# EAGLE design Main (EAGLE 6.3)
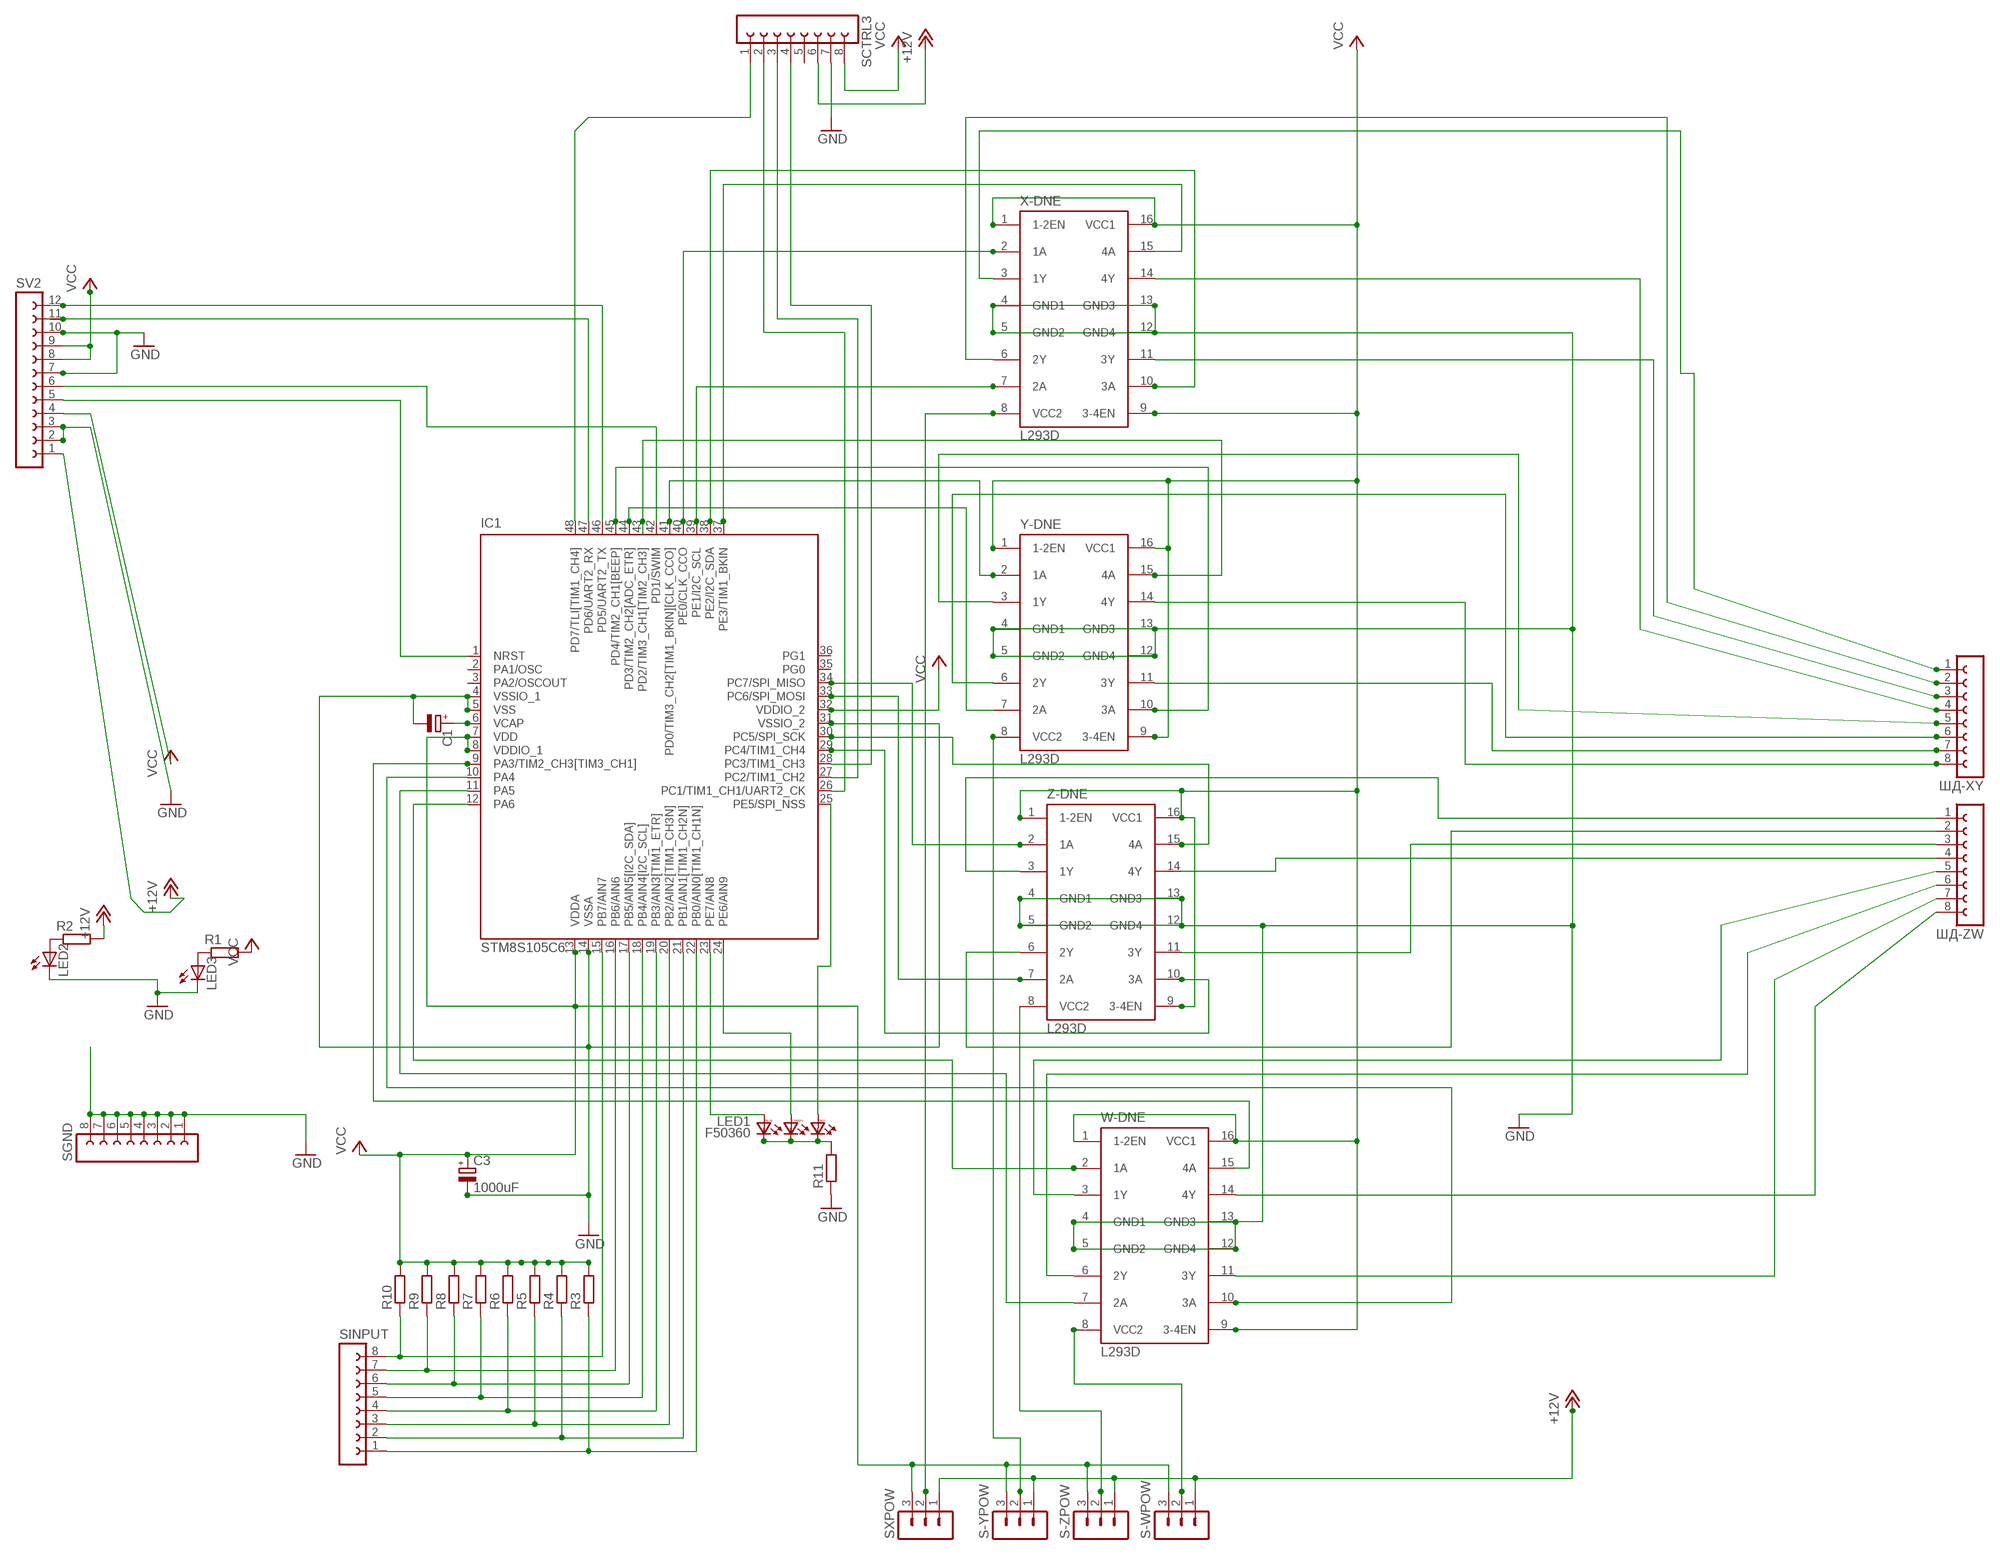
[diagram p0: schematic, sheet 1]

## Parts
C1  CPOL-EU085CS-1AR  [085CS_1AR]
C3  1000uF  CPOL-EUSANYO_9E  [SANYO-OSCON_9E]
IC1  STM8S105C6  [LQFP48-7X7]
LED1  F50360  [F50360]
LED2  LED3MM  [LED3MM]
LED3  LED3MM  [LED3MM]
R1  R-EU_0204/7  [0204/7]
R2  R-EU_0204/7  [0204/7]
R3  R-EU_M0805  [M0805]
R4  R-EU_M0805  [M0805]
R5  R-EU_M0805  [M0805]
R6  R-EU_M0805  [M0805]
R7  R-EU_M0805  [M0805]
R8  R-EU_M0805  [M0805]
R9  R-EU_M0805  [M0805]
R10  R-EU_M0805  [M0805]
R11  R-EU_0204/7  [0204/7]
S-WPOW  MA03-1  [MA03-1]
S-YPOW  MA03-1  [MA03-1]
S-ZPOW  MA03-1  [MA03-1]
SCTRL3  FE08-1  [FE08]
SGND  FE08-1  [FE08]
SINPUT  FE08-1  [FE08]
SV2  FE12-1  [FE12]
SXPOW  MA03-1  [MA03-1]
W-DNE  L293D  [DIL16]
X-DNE  L293D  [DIL16]
Y-DNE  L293D  [DIL16]
Z-DNE  L293D  [DIL16]
ШД-XY  FE08-1  [FE08]
ШД-ZW  FE08-1  [FE08]

## Nets
+12V: R2.2 S-WPOW.1 S-YPOW.1 S-ZPOW.1 SCTRL3.6 SV2.1 SXPOW.1
GND: C1.- C3.- IC1.4(VSSIO_1) IC1.5(VSS) IC1.14(VSSA) IC1.31(VSSIO_2) LED2.K(C) LED3.K(C) R11.1 SCTRL3.7 SGND.1 SGND.2 SGND.3 SGND.4 SGND.5 SGND.6 SGND.7 SGND.8 SV2.2 SV2.3 SV2.7 SV2.10 W-DNE.4(GND1) W-DNE.5(GND2) W-DNE.12(GND4) W-DNE.13(GND3) X-DNE.4(GND1) X-DNE.5(GND2) X-DNE.12(GND4) X-DNE.13(GND3) Y-DNE.4(GND1) Y-DNE.5(GND2) Y-DNE.12(GND4) Y-DNE.13(GND3) Z-DNE.4(GND1) Z-DNE.5(GND2) Z-DNE.12(GND4) Z-DNE.13(GND3)
IN-Y1: IC1.41(PD0/TIM3_CH2[TIM1_BKIN][CLK_CCO]) Y-DNE.2(1A)
IN-Y2: IC1.44(PD3/TIM2_CH2[ADC_ETR]) Y-DNE.7(2A)
IN-Y3: IC1.45(PD4/TIM2_CH1[BEEP]) Y-DNE.10(3A)
IN-Y4: IC1.43(PD2/TIM3_CH1[TIM2_CH3]) Y-DNE.15(4A)
N$1: IC1.22(PB0/AIN0[TIM1_CH1N]) R3.1 SINPUT.1
N$6: IC1.47(PD6/UART2_RX) SV2.11
N$7: C1.+ IC1.6(VCAP)
N$13: IC1.40(PE0/CLK_CCO) X-DNE.2(1A)
N$14: IC1.39(PE1/I2C_SCL) X-DNE.7(2A)
N$15: IC1.38(PE2/I2C_SDA) X-DNE.10(3A)
N$16: IC1.37(PE3/TIM1_BKIN) X-DNE.15(4A)
N$17: IC1.34(PC7/SPI_MISO) Z-DNE.2(1A)
N$18: IC1.33(PC6/SPI_MOSI) Z-DNE.7(2A)
N$19: IC1.30(PC5/SPI_SCK) Z-DNE.15(4A)
N$20: IC1.29(PC4/TIM1_CH4) Z-DNE.10(3A)
N$21: IC1.9(PA3/TIM2_CH3[TIM3_CH1]) W-DNE.15(4A)
N$22: IC1.10(PA4) W-DNE.10(3A)
N$23: IC1.11(PA5) W-DNE.7(2A)
N$24: IC1.12(PA6) W-DNE.2(1A)
N$35: IC1.21(PB1/AIN1[TIM1_CH2N]) R4.1 SINPUT.2
N$36: IC1.20(PB2/AIN2[TIM1_CH3N]) R5.1 SINPUT.3
N$38: IC1.19(PB3/AIN3[TIM1_ETR]) R6.1 SINPUT.4
N$41: IC1.18(PB4/AIN4[I2C_SCL]) R7.1 SINPUT.5
N$42: IC1.17(PB5/AIN5[I2C_SDA]) R8.1 SINPUT.6
N$43: IC1.16(PB6/AIN6) R9.1 SINPUT.7
N$44: IC1.15(PB7/AIN7) R10.1 SINPUT.8
N$45: LED1.BC LED1.GC LED1.RC R11.2
N$46: IC1.23(PE7/AIN8) LED1.BA
N$47: IC1.24(PE6/AIN9) LED1.GA
N$48: IC1.25(PE5/SPI_NSS) LED1.RA
N$49: IC1.48(PD7/TLI[TIM1_CH4]) SCTRL3.1
N$50: IC1.27(PC2/TIM1_CH2) SCTRL3.3
N$51: IC1.28(PC3/TIM1_CH3) SCTRL3.4
N$59: LED3.A R1.1
N$60: LED2.A R2.1
N$66: IC1.26(PC1/TIM1_CH1/UART2_CK) SCTRL3.2
PW1: W-DNE.3(1Y) ШД-ZW.5
PW2: W-DNE.6(2Y) ШД-ZW.6
PW3: W-DNE.11(3Y) ШД-ZW.7
PW4: W-DNE.14(4Y) ШД-ZW.8
PX1: X-DNE.3(1Y) ШД-XY.1
PX2: X-DNE.6(2Y) ШД-XY.2
PX3: X-DNE.11(3Y) ШД-XY.3
PX4: X-DNE.14(4Y) ШД-XY.4
PY1: Y-DNE.3(1Y) ШД-XY.5
PY2: Y-DNE.6(2Y) ШД-XY.6
PY3: Y-DNE.11(3Y) ШД-XY.7
PY4: Y-DNE.14(4Y) ШД-XY.8
PZ1: Z-DNE.3(1Y) ШД-ZW.1
PZ2: Z-DNE.6(2Y) ШД-ZW.2
PZ3: Z-DNE.11(3Y) ШД-ZW.3
PZ4: Z-DNE.14(4Y) ШД-ZW.4
RST: IC1.1(NRST) SV2.5
SWD: IC1.42(PD1/SWIM) SV2.6
TXD: IC1.46(PD5/UART2_TX) SV2.12
VCC: C3.+ IC1.7(VDD) IC1.8(VDDIO_1) IC1.13(VDDA) IC1.32(VDDIO_2) R1.2 R3.2 R4.2 R5.2 R6.2 R7.2 R8.2 R9.2 R10.2 S-WPOW.3 S-YPOW.3 S-ZPOW.3 SCTRL3.8 SV2.4 SV2.8 SV2.9 SXPOW.3 W-DNE.1(1-2EN) W-DNE.9(3-4EN) W-DNE.16(VCC1) X-DNE.1(1-2EN) X-DNE.9(3-4EN) X-DNE.16(VCC1) Y-DNE.1(1-2EN) Y-DNE.9(3-4EN) Y-DNE.16(VCC1) Z-DNE.1(1-2EN) Z-DNE.9(3-4EN) Z-DNE.16(VCC1)
VCC_W_SEL: S-WPOW.2 W-DNE.8(VCC2)
VCC_X_SEL: SXPOW.2 X-DNE.8(VCC2)
VCC_Y_SEL: S-YPOW.2 Y-DNE.8(VCC2)
VCC_Z_SEL: S-ZPOW.2 Z-DNE.8(VCC2)
Unconnected: IC1.2(PA1/OSC) IC1.3(PA2/OSCOUT) IC1.35(PG0) IC1.36(PG1) SCTRL3.5

## Library data of the parts
C1 = resistor:CPOL-EU: POLARIZED CAPACITOR, European symbol
C3 = rcl:CPOL-EU: POLARIZED CAPACITOR, European symbol
IC1 = st-microelectronics:STM8S105C: Access line, 16 MHz STM8S 8-bit MCU up to 32 Kbytes Flash, integrated EEPROM,10-bit ADC, timers, UART, SPI, I²C Source: Data sheet <http://www.st.com/stonline/products/literature/ds/14771/stm8s105c4.pdf>; MPN: STM8S105C6T6; OC_FARNELL: 1706222; OC_NEWARK: 09R6033
LED1 = led:F50360: Full color Z-Power LED RGB P5-II Series Source: http://www.seoulsemicon.co.kr .. F50360.pdf
LED2 LED3 = led:LED: LED OSRAM: - CHIPLED LG R971, LG N971, LY N971, LG Q971, LY Q971, LO R971, LY R971 LH N974, LH R974 LS Q976, LO Q976, LY Q976 LO Q996 - Hyper CHIPLED LW Q18S LB Q993, LB Q99A, LB R99A - SideLED LS A670, LO A670, LY A670, LG A670, LP A670 LB A673, LV A673, LT A673, LW A673 LH A674 LY A675 LS A676, LA A676, LO A676, LY A676, LW A676 LS A679, LY A679, LG A679 - Hyper Micro SIDELED® LS Y876, LA Y876, LO Y876, LY Y876 LT Y87S - SmartLED LW L88C, LW L88S LB L89C, LB L89S, LG L890 LS L89K, LO L89K, LY L89K LS L896, LA L896, LO L896, LY L896 - TOPLED LS T670, LO T670, LY T670, LG T670, LP T670 LSG T670, LSP T670, LSY T670, LOP T670, LYG T670 LG T671, LOG T671, LSG T671 LB T673, LV T673, LT T673, LW T673 LH T674 LS T676, LA T676, LO T676, LY T676, LB T676, LH T676, LSB T676, LW T676 LB T67C, LV T67C, LT T67C, LS T67K, LO T67K, LY T67K, LW E67C LS E67B, LA E67B, LO E67B, LY E67B, LB E67C, LV E67C, LT E67C LW T67C LS T679, LY T679, LG T679 LS T770, LO T770, LY T770, LG T770, LP T770 LB T773, LV T773, LT T773, LW T773 LH T774 LS E675, LA E675, LY E675, LS T675 LS T776, LA T776, LO T776, LY T776, LB T776 LHGB T686 LT T68C, LB T68C - Hyper Mini TOPLED® LB M676 - Mini TOPLED Santana® LG M470 LS M47K, LO M47K, LY M47K Source: http://www.osram.convergy.de LUXEON: - LUMILED® LXK2-PW12-R00, LXK2-PW12-S00, LXK2-PW14-U00, LXK2-PW14-V00 LXK2-PM12-R00, LXK2-PM12-S00, LXK2-PM14-U00 LXK2-PE12-Q00, LXK2-PE12-R00, LXK2-PE12-S00, LXK2-PE14-T00, LXK2-PE14-U00 LXK2-PB12-K00, LXK2-PB12-L00, LXK2-PB12-M00, LXK2-PB14-N00, LXK2-PB14-P00, LXK2-PB14-Q00 LXK2-PR12-L00, LXK2-PR12-M00, LXK2-PR14-Q00, LXK2-PR14-R00 LXK2-PD12-Q00, LXK2-PD12-R00, LXK2-PD12-S00 LXK2-PH12-R00, LXK2-PH12-S00 LXK2-PL12-P00, LXK2-PL12-Q00, LXK2-PL12-R00 Source: www.luxeon.com KINGBRIGHT: KA-3528ASYC Source: www.kingbright.com
R1-R11 = resistor:R-EU_: RESISTOR, European symbol
S-WPOW S-YPOW S-ZPOW SXPOW = con-lstb:MA03-1: PIN HEADER; OC_FARNELL: unknown; OC_NEWARK: unknown
SCTRL3 SGND SINPUT ШД-XY ШД-ZW = con-lsta:FE08-1: FEMALE HEADER; OC_FARNELL: unknown; OC_NEWARK: unknown
SV2 = con-lsta:FE12-1: FEMALE HEADER; OC_FARNELL: unknown; OC_NEWARK: unknown
W-DNE X-DNE Y-DNE Z-DNE = st-microelectronics:L293D: PUSH-PULL 4 CHANNEL DRIVER; MPN: L293D; OC_FARNELL: 9589619; OC_NEWARK: 56P8249

## Board
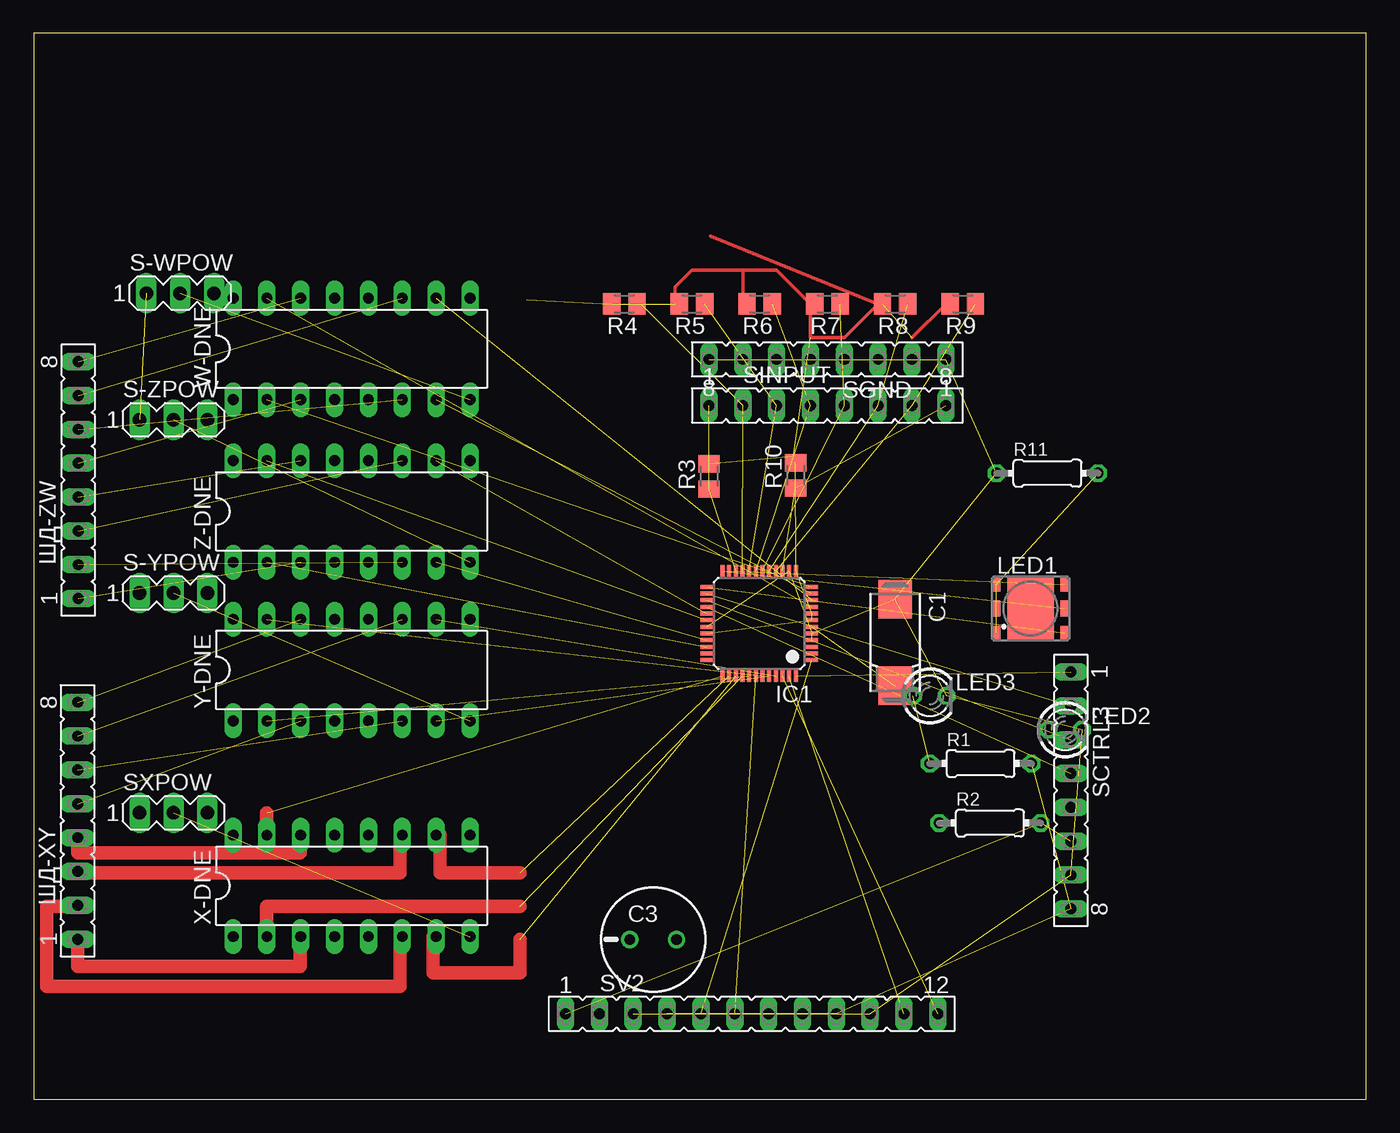
[diagram p1: board, top side]
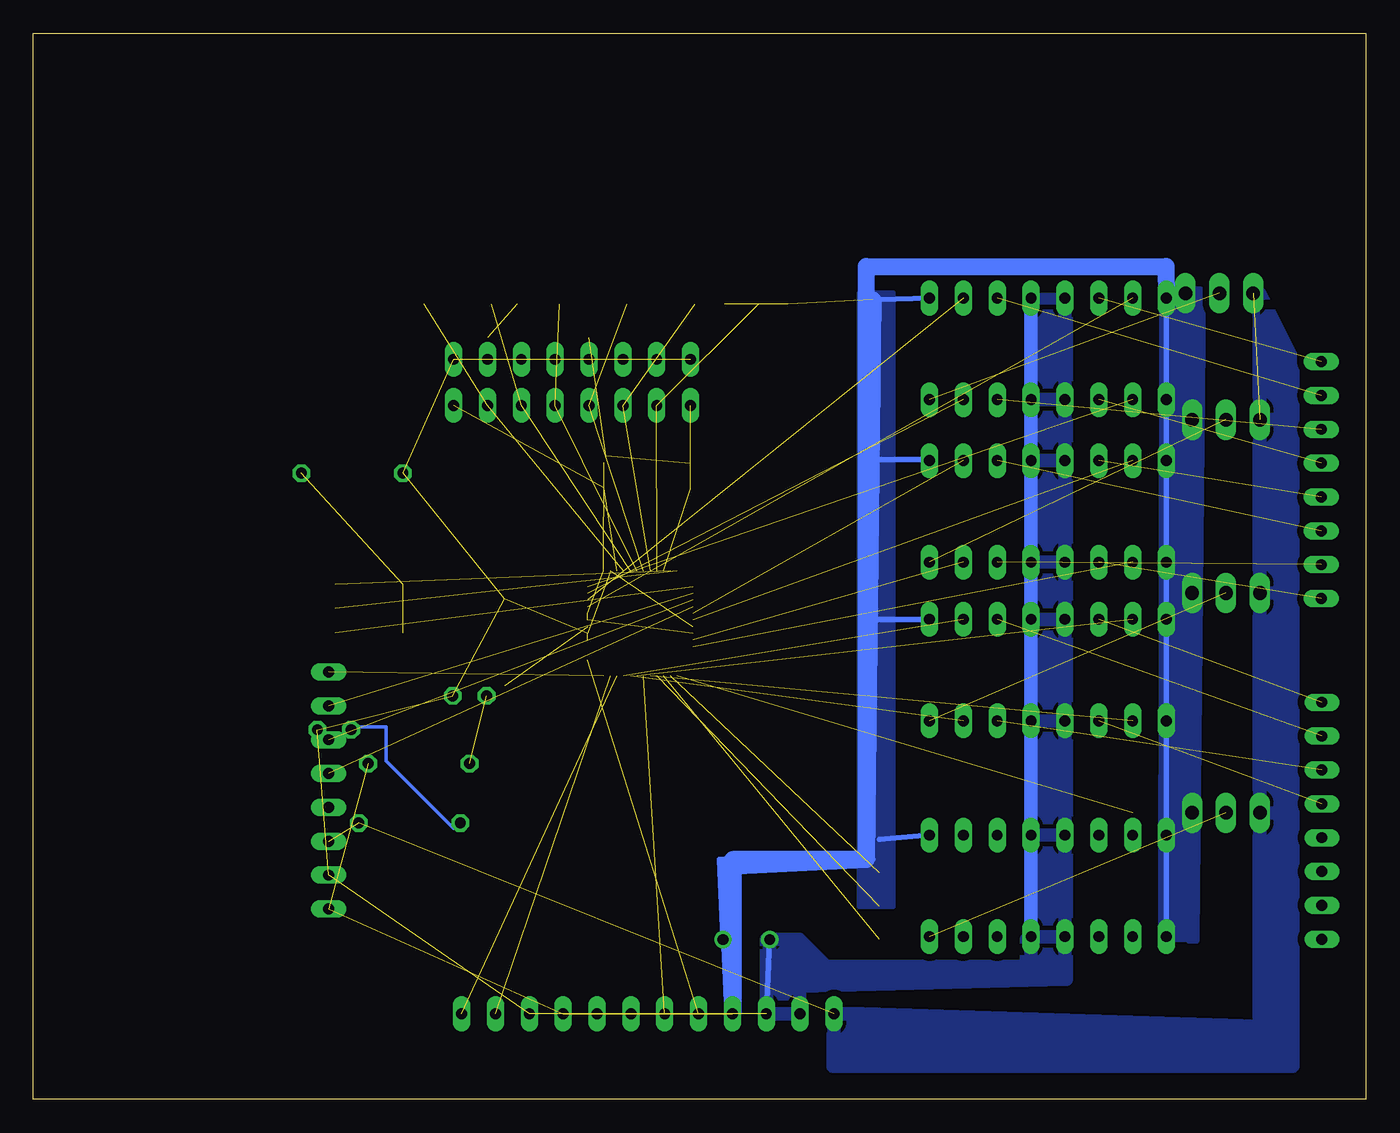
[diagram p2: board, bottom side, seen from below]

Size 100 x 80 mm. Coordinates in mm from the lower left corner, seen from the top.
Outline: 0,0 100,0 100,80 0,80 0,0
Copper layers (1*16): Top 0.035mm / dielectric 1.5mm / Bottom 0.035mm
Design rules "default *": minimum track width 10mil, minimum drill 24mil, track to track 0.5mm, track to pad 0.5mm, pad to pad 0.5mm, via to via 0.5mm, smd to smd 0.1mm, copper to edge 40mil, drill to drill 8mil, minimum pad ring 10mil, minimum via ring 8mil, stop-mask expansion 4mil, vias tented up to drill 0mil, thermal gap 10mil

### Footprints (pad centres in the part's own frame; a part is rotated, then mirrored left to right if it is on the bottom)
085CS_1AR = smd 2.9 x 2.5: + 3.25,0; - -3.25,0
SANYO-OSCON_9E = drill 0.8 pad 1.27: + 1.75,0; - -1.75,0
LQFP48-7X7 = smd 0.9 x 0.3: 1 -3.95,2.75; 2 -3.95,2.25; 3 -3.95,1.75; 4 -3.95,1.25; 5 -3.95,0.75; 6 -3.95,0.25; 7 -3.95,-0.25; 8 -3.95,-0.75; 9 -3.95,-1.25; 10 -3.95,-1.75; 11 -3.95,-2.25; 12 -3.95,-2.75; 25 3.95,-2.75; 26 3.95,-2.25; 27 3.95,-1.75; 28 3.95,-1.25; 29 3.95,-0.75; 30 3.95,-0.25; 31 3.95,0.25; 32 3.95,0.75; 33 3.95,1.25; 34 3.95,1.75; 35 3.95,2.25; 36 3.95,2.75 | smd 0.3 x 0.9: 13 -2.75,-3.95; 14 -2.25,-3.95; 15 -1.75,-3.95; 16 -1.25,-3.95; 17 -0.75,-3.95; 18 -0.25,-3.95; 19 0.25,-3.95; 20 0.75,-3.95; 21 1.25,-3.95; 22 1.75,-3.95; 23 2.25,-3.95; 24 2.75,-3.95; 37 2.75,3.95; 38 2.25,3.95; 39 1.75,3.95; 40 1.25,3.95; 41 0.75,3.95; 42 0.25,3.95; 43 -0.25,3.95; 44 -0.75,3.95; 45 -1.25,3.95; 46 -1.75,3.95; 47 -2.25,3.95; 48 -2.75,3.95
F50360 = smd 0.6 x 1.05: BA 2.55,1.825; BC -2.55,1.825; RA 2.55,-1.825; RC -2.55,-1.825 | smd 0.6 x 1.2: GA 2.55,0; GC -2.55,0 | smd 3.5 x 4.7: NC 0,0
LED3MM = drill 0.813 octagon: A -1.27,0; K 1.27,0
0204/7 = drill 0.813 octagon: 1 -3.81,0; 2 3.81,0
M0805 = smd 1.3 x 1.6: 1 -0.95,0; 2 0.95,0
MA03-1 = drill 1.016 long: 1 -2.54,0; 2 0,0; 3 2.54,0
FE08 = drill 0.813 long: 1 -8.89,0; 2 -6.35,0; 3 -3.81,0; 4 -1.27,0; 5 1.27,0; 6 3.81,0; 7 6.35,0; 8 8.89,0
FE12 = drill 0.813 long: 1 -13.97,0; 2 -11.43,0; 3 -8.89,0; 4 -6.35,0; 5 -3.81,0; 6 -1.27,0; 7 1.27,0; 8 3.81,0; 9 6.35,0; 10 8.89,0; 11 11.43,0; 12 13.97,0
DIL16 = drill 0.813 long: 1 -8.89,-3.81; 2 -6.35,-3.81; 3 -3.81,-3.81; 4 -1.27,-3.81; 5 1.27,-3.81; 6 3.81,-3.81; 7 6.35,-3.81; 8 8.89,-3.81; 9 8.89,3.81; 10 6.35,3.81; 11 3.81,3.81; 12 1.27,3.81; 13 -1.27,3.81; 14 -3.81,3.81; 15 -6.35,3.81; 16 -8.89,3.81

### Placement (x,y rotation side)
C1  64.65,34.29 270 top
C3  46.5,12 0 top
IC1  54.45,35.71 180 top
LED1  74.81,36.83 0 top
LED2  77.42,27.74 0 top
LED3  67.26,30.28 0 top
R1  71.07,25.2 0 top
R2  71.77,20.74 0 top
R3  50.69,46.75 90 top
R4  44.33,59.69 180 top
R5  49.41,59.69 180 top
R6  54.49,59.69 180 top
R7  59.57,59.69 180 top
R8  64.65,59.69 180 top
R9  69.73,59.69 180 top
R10  57.19,46.83 90 top
R11  76.08,46.99 0 top
S-WPOW  11,60.5 0 top
S-YPOW  10.5,38 0 top
S-ZPOW  10.5,51 0 top
SCTRL3  77.84,23.18 270 top
SGND  59.57,55.53 180 top
SINPUT  59.57,52.07 0 top
SV2  53.89,6.42 0 top
SXPOW  10.5,21.5 0 top
W-DNE  23.86,56.32 0 top
X-DNE  23.86,16.02 0 top
Y-DNE  23.86,32.22 0 top
Z-DNE  23.86,44.12 0 top
ШД-XY  3.31,20.91 90 top
ШД-ZW  3.35,46.47 90 top

### Tracks (layer width: path | path; a pad name or v marks a point on that pad's centre or on a via)
+12V  (3 unrouted)
  pour Bottom: 5.5,55.5 8,60.5 8,5.5 40,6.5 40,2.5 5.5,2.5
GND  (19 unrouted)
  Top 0.254: IC1.31 50.46,35.5
  Bottom 0.406: C3.- SV2.3
  Bottom 1.016: W-DNE.12 X-DNE.5
  pour Bottom: 22.5,11.5 25.5,12 25.5,10 40.5,10 42.5,12 45,12 45,6 42.5,6 42.5,8.5 22.5,9
  pour Bottom: 25,60 25,11.5 22.5,11.5 22.5,60
IN-Y1  (1 unrouted)
IN-Y2  (1 unrouted)
IN-Y3  (1 unrouted)
IN-Y4  (1 unrouted)
N$1  (2 unrouted)
N$6  (1 unrouted)
N$7  (1 unrouted)
N$13  (1 unrouted)
  Top 1.016: X-DNE.2 17.5,14.5 36.5,14.5
N$14  (1 unrouted)
  Top 1.016: X-DNE.7 30,12.21 30,9.5 36.5,9.5 36.5,12
N$15  (1 unrouted)
  Top 1.016: X-DNE.10 30.5,19.83 30.5,17 36.5,17
N$16  (1 unrouted)
  Top 1.016: X-DNE.15 17.5,21.5
N$17  (1 unrouted)
N$18  (1 unrouted)
N$19  (1 unrouted)
N$20  (1 unrouted)
N$21  (1 unrouted)
N$22  (1 unrouted)
N$23  (1 unrouted)
N$24  (1 unrouted)
N$35  (2 unrouted)
  Top 0.254: 45.6,59.69 R4.1
N$36  (2 unrouted)
N$38  (2 unrouted)
N$41  (2 unrouted)
N$42  (2 unrouted)
N$43  (2 unrouted)
N$44  (2 unrouted)
N$45  (3 unrouted)
N$46  (1 unrouted)
N$47  (1 unrouted)
N$48  (1 unrouted)
N$49  (1 unrouted)
N$50  (1 unrouted)
N$51  (1 unrouted)
N$59  (1 unrouted)
N$60
  Bottom 0.254: R2.1 68.46,20.32 73.54,25.4 73.54,27.94 76.08,27.94 LED2.A
N$66  (1 unrouted)
PW1  (1 unrouted)
PW2  (1 unrouted)
PW3  (1 unrouted)
PW4  (1 unrouted)
PX1
  Top 1.016: X-DNE.3 20,12.21 20,10 3.31,10 ШД-XY.1
PX2
  Top 1.016: X-DNE.6 27.5,12.21 27.5,8.5 1,8.5 1,14.5 3.31,14.5 ШД-XY.2
PX3
  Top 1.016: X-DNE.11 27.5,19.83 27.5,17 3.31,17 ШД-XY.3
PX4
  Top 1.016: X-DNE.14 20,19.83 20,18.5 3.31,18.5 ШД-XY.4
PY1  (1 unrouted)
PY2  (1 unrouted)
PY3  (1 unrouted)
PY4  (1 unrouted)
PZ1  (1 unrouted)
PZ2  (1 unrouted)
PZ3  (1 unrouted)
PZ4  (1 unrouted)
RST  (1 unrouted)
SWD  (1 unrouted)
TXD  (1 unrouted)
VCC  (13 unrouted)
  Top 0.254: 74.81,25.4 R1.2 | 53.22,62.23 49.41,62.23 48.14,60.96 48.14,59.69 R5.2 | 53.22,62.23 53.22,59.69 R6.2 | 58.3,59.69 55.76,62.23 53.22,62.23 | 63.38,59.69 60.84,57.15 58.3,57.15 58.3,59.69 | 58.3,59.69 R7.2 | 65.92,57.15 68.46,59.69 R9.2 | 57.03,48.26 R10.2 | 50.8,64.77 63.38,59.69 | 63.38,59.69 R8.2
  Bottom 0.406: SV2.4 C3.+ 48.5,18 47.5,18 | W-DNE.16 X-DNE.1 | Z-DNE.9 32.5,48 37,48 | 37.5,18 37,18 | X-DNE.9 36.5,19.5 | Y-DNE.9 36.5,36 | W-DNE.9 36.5,60 37,60
  Bottom 1.27: 37,60 37.5,18 | 37.5,18 47.5,18 47.5,6.5 48,17.5 37.5,18 | 37.5,18 37.5,62.5 15,62.5 W-DNE.16
  pour Bottom (no thermals): 35.5,60.5 38,60.5 38,14.5 35.5,14.5
  pour Bottom (no thermals): 12.5,60.5 15,60.5 15.1,12.3 13,12.3 13,12
VCC_W_SEL  (1 unrouted)
VCC_X_SEL  (1 unrouted)
VCC_Y_SEL  (1 unrouted)
VCC_Z_SEL  (1 unrouted)